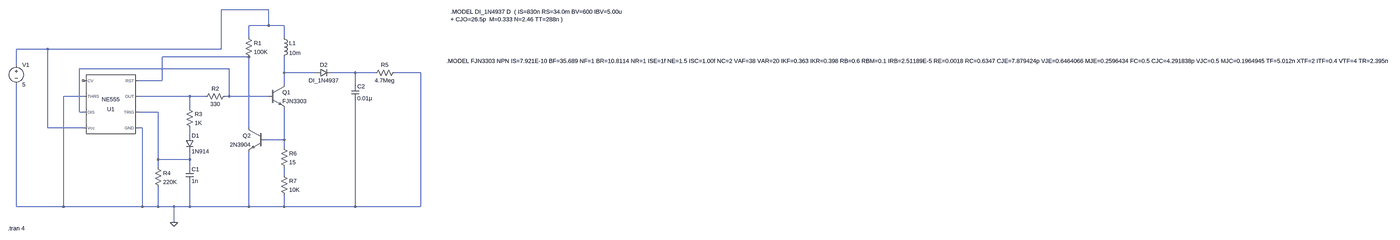
[diagram p0: schematic Cap_with_555.asc, whole sheet]
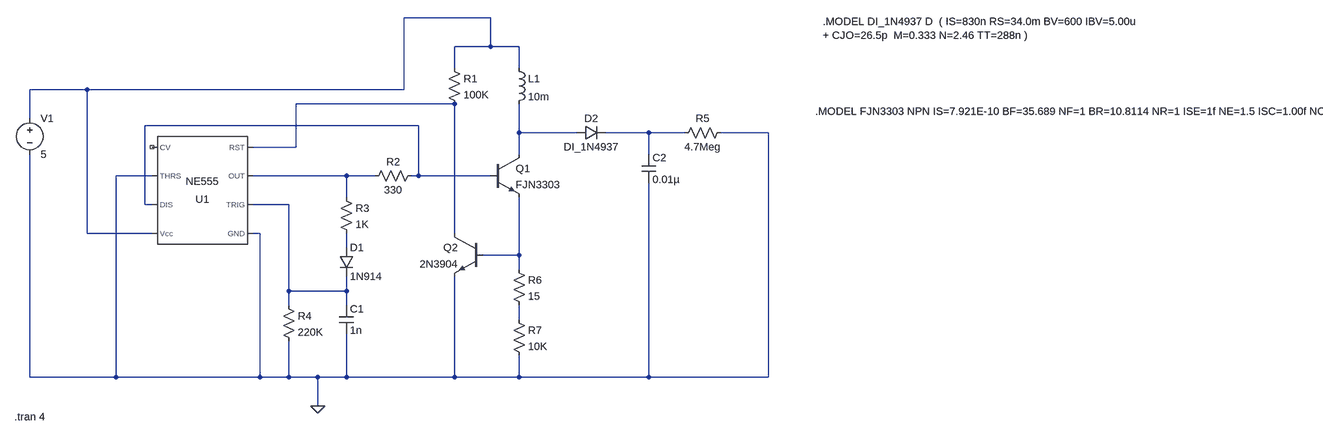
[diagram p1: schematic Cap_with_555.asc, part, row 1 of 1, column 1 of 2]
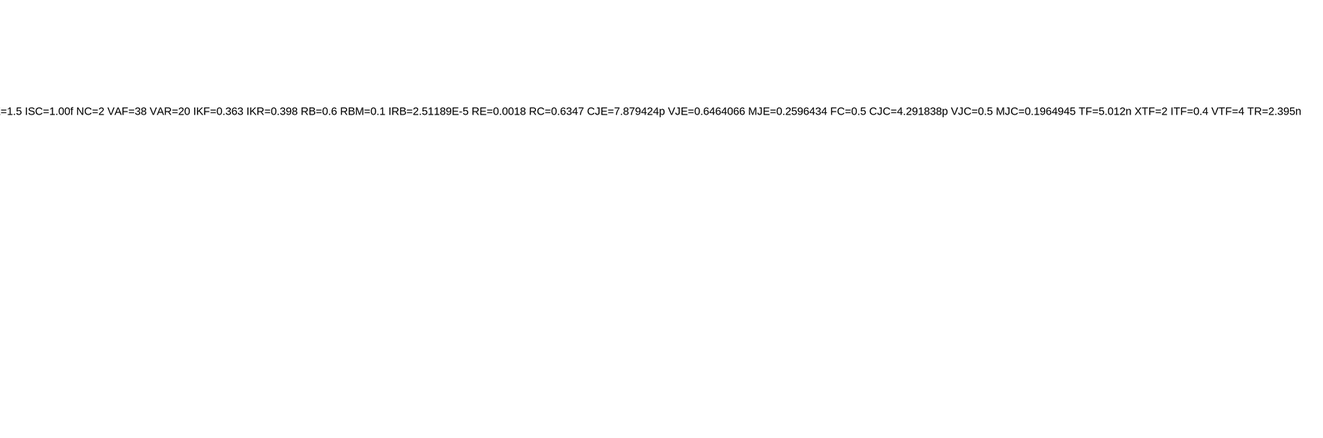
[diagram p2: schematic Cap_with_555.asc, part, row 1 of 1, column 2 of 2]
Cap_with_555.asc, the LTspice schematic file:
Version 4
SHEET 1 6692 744
WIRE 832 -160 640 -160
WIRE 832 -96 832 -160
WIRE 832 -96 752 -96
WIRE 896 -96 832 -96
WIRE 752 -48 752 -96
WIRE 896 -48 896 -96
WIRE -64 0 -192 0
WIRE 640 0 640 -160
WIRE 640 0 -64 0
WIRE 752 32 400 32
WIRE -192 64 -192 0
WIRE 672 80 64 80
WIRE 896 96 896 32
WIRE 1024 96 896 96
WIRE 1184 96 1088 96
WIRE 1264 96 1184 96
WIRE 1488 96 1344 96
WIRE 400 128 400 32
WIRE 400 128 304 128
WIRE 896 144 896 96
WIRE 1184 144 1184 96
WIRE 80 192 0 192
WIRE 512 192 304 192
WIRE 576 192 512 192
WIRE 672 192 672 80
WIRE 672 192 656 192
WIRE 832 192 672 192
WIRE 512 240 512 192
WIRE 64 256 64 80
WIRE 80 256 64 256
WIRE 384 256 304 256
WIRE -64 320 -64 0
WIRE 80 320 -64 320
WIRE 320 320 304 320
WIRE 752 320 752 32
WIRE 512 352 512 320
WIRE 896 368 896 240
WIRE 896 368 816 368
WIRE 896 400 896 368
WIRE 384 448 384 256
WIRE 512 448 512 416
WIRE 512 448 384 448
WIRE 384 480 384 448
WIRE 512 480 512 448
WIRE 896 512 896 480
WIRE -192 640 -192 144
WIRE 0 640 0 192
WIRE 0 640 -192 640
WIRE 320 640 320 320
WIRE 320 640 0 640
WIRE 384 640 384 560
WIRE 384 640 320 640
WIRE 448 640 384 640
WIRE 512 640 512 544
WIRE 512 640 448 640
WIRE 752 640 752 416
WIRE 752 640 512 640
WIRE 896 640 896 592
WIRE 896 640 752 640
WIRE 1184 640 1184 208
WIRE 1184 640 896 640
WIRE 1488 640 1488 96
WIRE 1488 640 1184 640
WIRE 448 704 448 640
FLAG 448 704 0
SYMBOL Misc\\NE555 192 224 R180
SYMATTR InstName U1
SYMBOL res 736 -64 R0
SYMATTR InstName R1
SYMATTR Value 100K
SYMBOL res 672 176 R90
WINDOW 0 0 56 VBottom 2
WINDOW 3 32 56 VTop 2
SYMATTR InstName R2
SYMATTR Value 330
SYMBOL res 496 224 R0
SYMATTR InstName R3
SYMATTR Value 1K
SYMBOL res 368 464 R0
SYMATTR InstName R4
SYMATTR Value 220K
SYMBOL diode 496 352 R0
SYMATTR InstName D1
SYMATTR Value 1N914
SYMBOL cap 496 480 R0
SYMATTR InstName C1
SYMATTR Value 1n
SYMBOL ind 880 -64 R0
SYMATTR InstName L1
SYMATTR Value 10m
SYMBOL diode 1024 112 R270
WINDOW 0 32 32 VTop 2
WINDOW 3 0 32 VBottom 2
SYMATTR InstName D2
SYMATTR Value DI_1N4937
SYMBOL npn 832 144 R0
SYMATTR InstName Q1
SYMATTR Value FJN3303
SYMBOL npn 816 320 M0
SYMATTR InstName Q2
SYMATTR Value 2N3904
SYMBOL cap 1168 144 R0
SYMATTR InstName C2
SYMATTR Value 0.01µ
SYMBOL res 1360 80 R90
WINDOW 0 0 56 VBottom 2
WINDOW 3 32 56 VTop 2
SYMATTR InstName R5
SYMATTR Value 4.7Meg
SYMBOL res 880 384 R0
SYMATTR InstName R6
SYMATTR Value 15
SYMBOL res 880 496 R0
SYMATTR InstName R7
SYMATTR Value 10K
SYMBOL voltage -192 48 R0
WINDOW 123 0 0 Left 0
WINDOW 39 0 0 Left 0
SYMATTR InstName V1
SYMATTR Value 5
TEXT 1872 -152 Left 2 !.MODEL DI_1N4937 D  ( IS=830n RS=34.0m BV=600 IBV=5.00u\n+ CJO=26.5p  M=0.333 N=2.46 TT=288n )
TEXT 1856 48 Left 2 !.MODEL FJN3303 NPN IS=7.921E-10 BF=35.689 NF=1 BR=10.8114 NR=1 ISE=1f NE=1.5 ISC=1.00f NC=2 VAF=38 VAR=20 IKF=0.363 IKR=0.398 RB=0.6 RBM=0.1 IRB=2.51189E-5 RE=0.0018 RC=0.6347 CJE=7.879424p VJE=0.6464066 MJE=0.2596434 FC=0.5 CJC=4.291838p VJC=0.5 MJC=0.1964945 TF=5.012n XTF=2 ITF=0.4 VTF=4 TR=2.395n XTB=1.5 EG=1.17 XTI=3 Vceo=400 Icrating=1.5 mfg=Fairchild
TEXT -226 728 Left 2 !.tran 4

The netlist it stands for:
* Cap_with_555.asc
XU1 0 N007 N006 N002 NC_01 0 N003 N001 NE555  ; pins GND TRIG OUT RST CV THRS DIS Vcc
R1 N001 N002 100K
R2 N003 N006 330
R3 N006 N008 1K
R4 N007 0 220K
D1 N008 N007 1N914
C1 N007 0 1n
L1 N001 N004 10m
D2 N004 N005 DI_1N4937
Q1 N004 N003 N009 0 FJN3303
Q2 N002 N009 0 0 2N3904
C2 N005 0 0.01µ
R5 0 N005 4.7Meg
R6 N009 N010 15
R7 N010 0 10K
V1 N001 0 5
.model D D
.lib standard.dio
.model NPN NPN
.model PNP PNP
.lib standard.bjt
.MODEL DI_1N4937 D  ( IS=830n RS=34.0m BV=600 IBV=5.00u
+ CJO=26.5p  M=0.333 N=2.46 TT=288n )
.MODEL FJN3303 NPN IS=7.921E-10 BF=35.689 NF=1 BR=10.8114 NR=1 ISE=1f NE=1.5 ISC=1.00f NC=2 VAF=38 VAR=20 IKF=0.363 IKR=0.398 RB=0.6 RBM=0.1 IRB=2.51189E-5 RE=0.0018 RC=0.6347 CJE=7.879424p VJE=0.6464066 MJE=0.2596434 FC=0.5 CJC=4.291838p VJC=0.5 MJC=0.1964945 TF=5.012n XTF=2 ITF=0.4 VTF=4 TR=2.395n XTB=1.5 EG=1.17 XTI=3 Vceo=400 Icrating=1.5 mfg=Fairchild
.tran 4
.lib NE555.sub
.backanno
.end